# Altium schematic sheet trinamic-controller-dribbler.SchDoc
size B; SheetNumber: 9; SheetTotal: 13
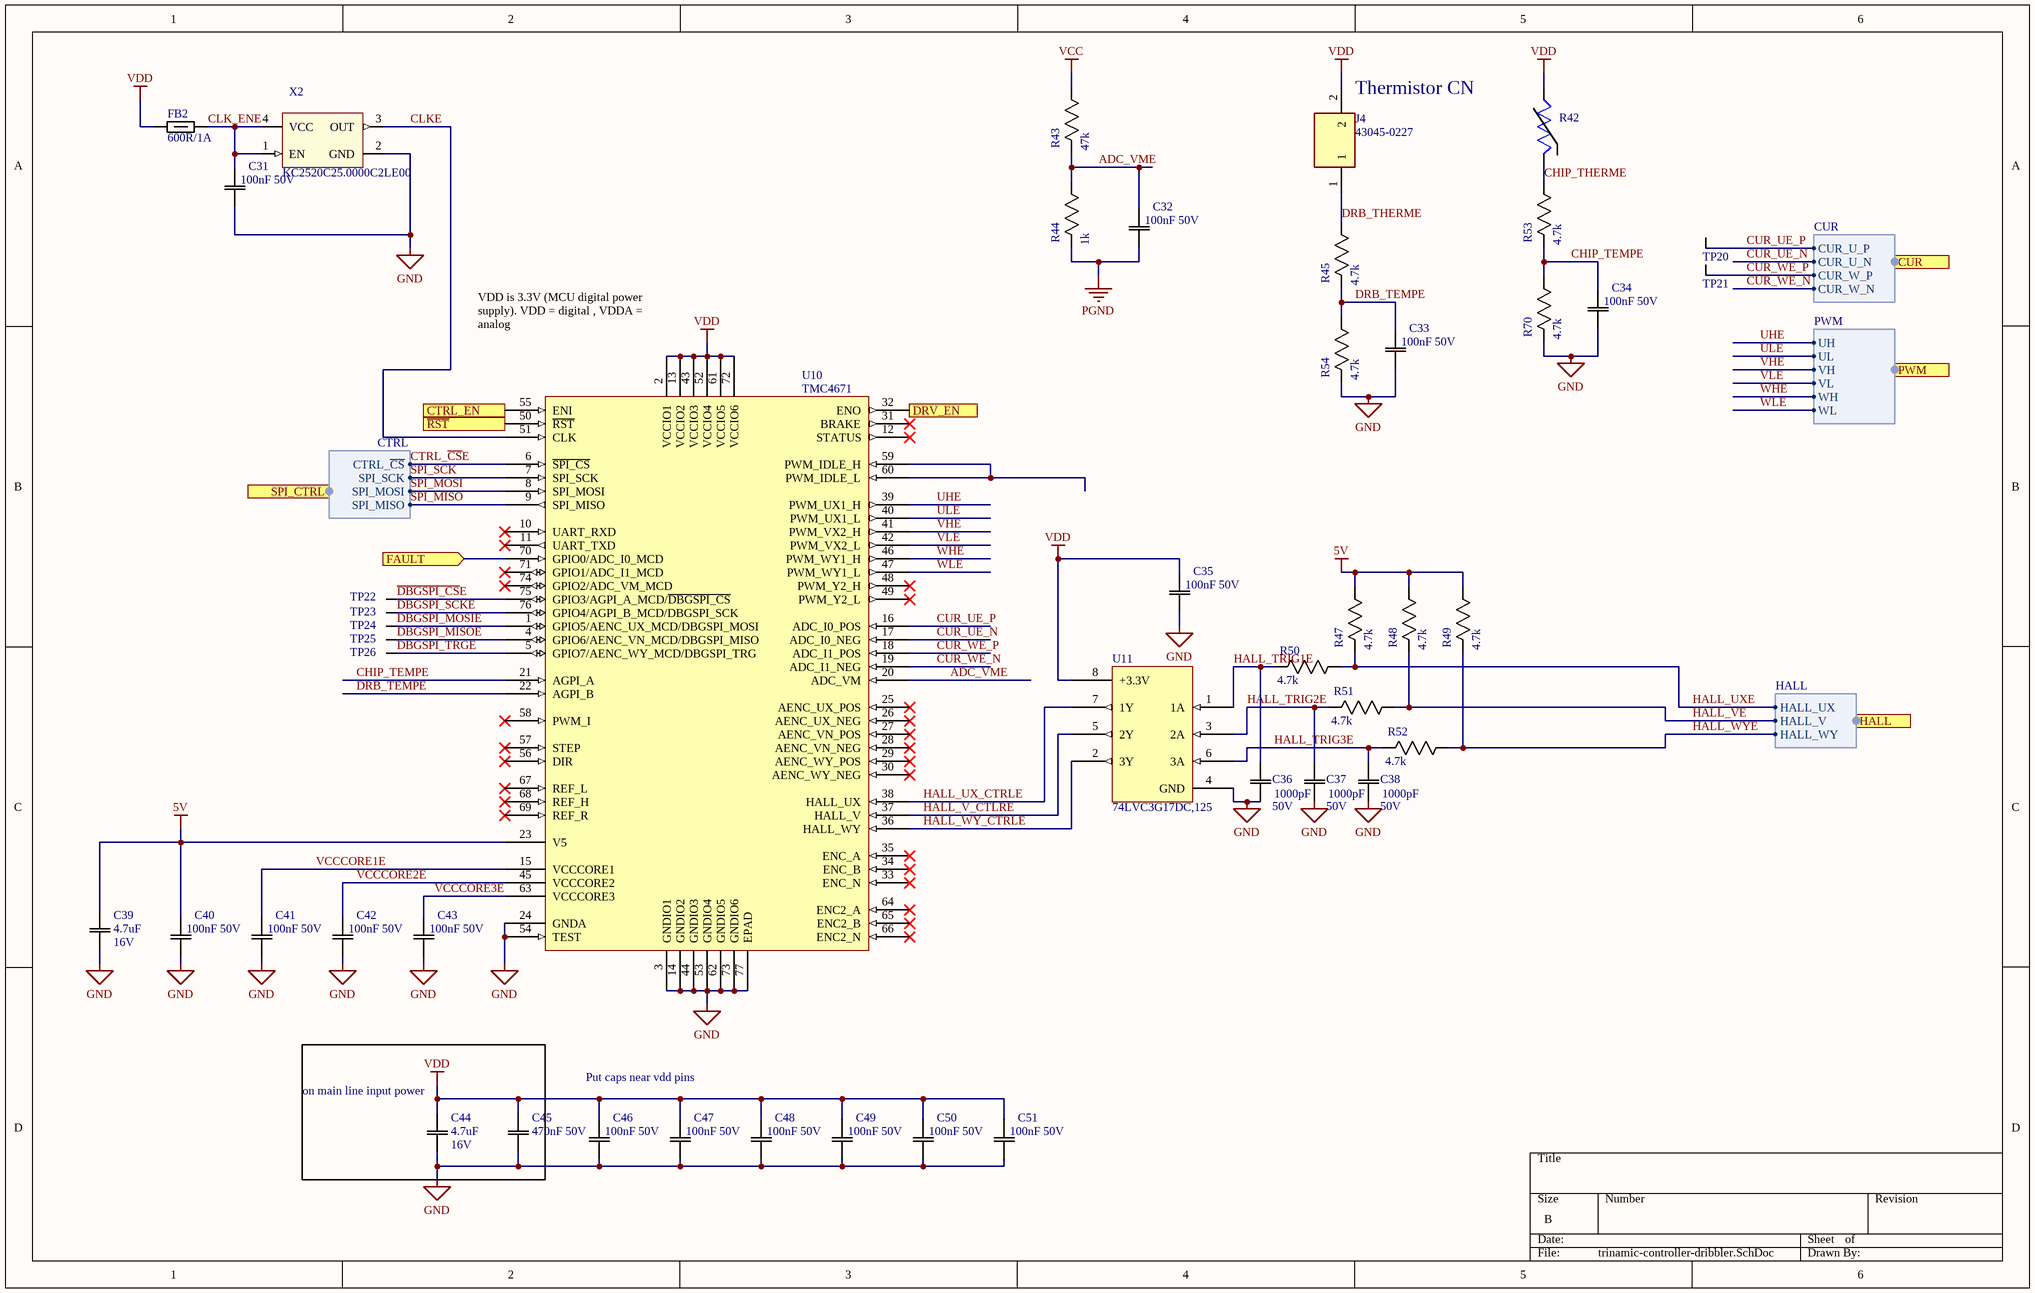
[diagram p0: trinamic-controller-dribbler.SchDoc]

## Parts
C31  100nF 50V  [0603]
C32  100nF 50V  [0603]
C33  100nF 50V  [0603]
C34  100nF 50V  [0603]
C35  100nF 50V  [0603]
C36  value 1000pF  Rating: 50V  [0603]  (hidden comment: 1000pF 50V)
C37  value 1000pF  Rating: 50V  [0603]  (hidden comment: 1000pF 50V)
C38  value 1000pF  Rating: 50V  [0603]  (hidden comment: 1000pF 50V)
C39  value 4.7uF  Rating: 16V  [0603]  (hidden comment: 4.7uF 16V)
C40  100nF 50V  [0603]
C41  100nF 50V  [0603]
C42  100nF 50V  [0603]
C43  100nF 50V  [0603]
C44  value 4.7uF  Rating: 16V  [0603]  (hidden comment: 4.7uF 16V)
C45  470nF 50V  [0603]
C46  100nF 50V  [0603]
C47  100nF 50V  [0603]
C48  100nF 50V  [0603]
C49  100nF 50V  [0603]
C50  100nF 50V  [0603]
C51  100nF 50V  [0603]
FB2  600R/1A  [0603]
J4  43045-0227  [MOLEX_0430450227]
R42  RES NTC 10k  [0603]  (value not drawn)
R43  47k  [0603]
R44  1k  [0603]
R45  4.7k  [0603]
R47  4.7k  [0603]
R48  4.7k  [0603]
R49  4.7k  [0603]
R50  4.7k  [0603]
R51  4.7k  [0603]
R52  4.7k  [0603]
R53  4.7k  [0603]
R54  4.7k  [0603]
R70  4.7k  [0603]
TP20  C_UE  [TP]  (value not drawn)  (no BOM)
TP21  C_WE  [TP]  (value not drawn)  (no BOM)
TP22  DBG_CS  [TP]  (value not drawn)  (no BOM)
TP23  DBG_SCK  [TP]  (value not drawn)  (no BOM)
TP24  DBG_MOSI  [TP]  (value not drawn)  (no BOM)
TP25  DBG_MISO  [TP]  (value not drawn)  (no BOM)
TP26  DBG_TRG  [TP]  (value not drawn)  (no BOM)
U10  TMC4671  [QFN40P1050X650X90_HS-77N]
U11  74LVC3G17DC,125  [8-VSSOP]
X2  KC2520C25.0000C2LE00  [KC2520C25.0000C2LE00]

## Blocks framed on the sheet
on main line input power: C44 C45

## Ports
CTRL_EN (in), CUR (harness CUR), DRV_EN (out), FAULT (in), HALL (harness HALL), PWM (harness PWM), SPI_CTRL (harness CTRL), ~{RST} (in)

## Harnesses
PWM: VL, WH, WL, VH, UL, UH
CTRL: SPI_SCK, SPI_MISO, SPI_MOSI, CTRL_~{CS}
CUR: CUR_U_P, CUR_W_P, CUR_U_N, CUR_W_N
HALL: HALL_UX, HALL_WY, HALL_V

## Nets
5V: C39.2(C2) C40.2(C2) R47.1(R1) R48.1(R1) R49.1(R1) U10.23(V5)
GND: C31.1(C1) C33.1(C1) C34.1(C1) C35.1(C1) C36.1(C1) C37.1(C1) C38.1(C1) C39.1(C1) C40.1(C1) C41.1(C1) C42.1(C1) C43.1(C1) C44.1(C1) C45.1(C1) C46.1(C1) C47.1(C1) C48.1(C1) C49.1(C1) C50.1(C1) C51.1(C1) R54.2(R2) R70.2(R2) U10.3(GNDIO1) U10.14(GNDIO2) U10.24(GNDA) U10.44(GNDIO3) U10.53(GNDIO4) U10.54(TEST) U10.62(GNDIO5) U10.73(GNDIO6) U10.77(EPAD) U11.4(GND) X2.2(GND)
PGND: C32.1(C1) R44.2(R2)
VCC: R43.1(R1)
VDD: C35.2(C2) C44.2(C2) C45.2(C2) C46.2(C2) C47.2(C2) C48.2(C2) C49.2(C2) C50.2(C2) C51.2(C2) FB2.1 J4.2 R42.2 U10.2(VCCIO1) U10.13(VCCIO2) U10.43(VCCIO3) U10.52(VCCIO4) U10.61(VCCIO5) U10.72(VCCIO6) U11.8(+3.3V)
ADC_VME: C32.2(C2) R43.2(R2) R44.1(R1) U10.20(ADC_VM)
CHIP_TEMPE: C34.2(C2) R53.2(R2) R70.1(R1) U10.21(AGPI_A)
CHIP_THERME: R42.1 R53.1(R1)
CLK_ENE: C31.2(C2) FB2.2 X2.1(EN) X2.4(VCC)
CLKE: U10.51(CLK) X2.3(OUT)
CTRL_~{CS}E: U10.6(~{SPI_CS}) ; port SPI_CTRL.CTRL_~{CS}
CTRL_EN: U10.55(ENI) ; port CTRL_EN
CUR_UE_N: U10.17(ADC_I0_NEG) ; port CUR.CUR_U_N
CUR_UE_P: TP20.1 U10.16(ADC_I0_POS) ; port CUR.CUR_U_P
CUR_WE_N: U10.19(ADC_I1_NEG) ; port CUR.CUR_W_N
CUR_WE_P: TP21.1 U10.18(ADC_I1_POS) ; port CUR.CUR_W_P
~{DBGSPI_CS}E: TP22.1 U10.75(GPIO3/AGPI_A_MCD/~{DBGSPI_CS})
DBGSPI_MISOE: TP25.1 U10.4(GPIO6/AENC_VN_MCD/DBGSPI_MISO)
DBGSPI_MOSIE: TP24.1 U10.1(GPIO5/AENC_UX_MCD/DBGSPI_MOSI)
DBGSPI_SCKE: TP23.1 U10.76(GPIO4/AGPI_B_MCD/DBGSPI_SCK)
DBGSPI_TRGE: TP26.1 U10.5(GPIO7/AENC_WY_MCD/DBGSPI_TRG)
DRB_TEMPE: C33.2(C2) R45.2(R2) R54.1(R1) U10.22(AGPI_B)
DRB_THERME: J4.1 R45.1(R1)
DRV_EN: U10.32(ENO) ; port DRV_EN
FAULT: U10.70(GPIO0/ADC_I0_MCD) ; port FAULT
HALL_TRIG1E: C36.2(C2) R50.2(R2) U11.1(1A)
HALL_TRIG2E: C37.2(C2) R51.2(R2) U11.3(2A)
HALL_TRIG3E: C38.2(C2) R52.2(R2) U11.6(3A)
HALL_UX_CTRLE: U10.38(HALL_UX) U11.7(1Y)
HALL_UXE: R47.2(R2) R50.1(R1) ; port HALL.HALL_UX
HALL_V_CTLRE: U10.37(HALL_V) U11.5(2Y)
HALL_VE: R48.2(R2) R51.1(R1) ; port HALL.HALL_V
HALL_WY_CTRLE: U10.36(HALL_WY) U11.2(3Y)
HALL_WYE: R49.2(R2) R52.1(R1) ; port HALL.HALL_WY
~{RST}: U10.50(~{RST}) ; port ~{RST}
SPI_MISO: U10.9(SPI_MISO) ; port SPI_CTRL.SPI_MISO
SPI_MOSI: U10.8(SPI_MOSI) ; port SPI_CTRL.SPI_MOSI
SPI_SCK: U10.7(SPI_SCK) ; port SPI_CTRL.SPI_SCK
UHE: U10.39(PWM_UX1_H) ; port PWM.UH
ULE: U10.40(PWM_UX1_L) ; port PWM.UL
VCCCORE1E: C41.2(C2) U10.15(VCCCORE1)
VCCCORE2E: C42.2(C2) U10.45(VCCCORE2)
VCCCORE3E: C43.2(C2) U10.63(VCCCORE3)
VHE: U10.41(PWM_VX2_H) ; port PWM.VH
VLE: U10.42(PWM_VX2_L) ; port PWM.VL
WHE: U10.46(PWM_WY1_H) ; port PWM.WH
WLE: U10.47(PWM_WY1_L) ; port PWM.WL
NetU10_59: U10.59(PWM_IDLE_H) U10.60(PWM_IDLE_L)

Not connected (* = marked no-connect by the designer): U10 10(UART_RXD)* 11(UART_TXD)* 12(STATUS)* 25(AENC_UX_POS)* 26(AENC_UX_NEG)* 27(AENC_VN_POS)* 28(AENC_VN_NEG)* 29(AENC_WY_POS)* 30(AENC_WY_NEG)* 31(BRAKE)* 33(ENC_N)* 34(ENC_B)* 35(ENC_A)* 48(PWM_Y2_H)* 49(PWM_Y2_L)* 56(DIR)* 57(STEP)* 58(PWM_I)* 64(ENC2_A)* 65(ENC2_B)* 66(ENC2_N)* 67(REF_L)* 68(REF_H)* 69(REF_R)* 71(GPIO1/ADC_I1_MCD)* 74(GPIO2/ADC_VM_MCD)*

## Notes on the sheet
- (near J4) Thermistor CN
- (near U10) VDD is 3.3V (MCU digital power supply). VDD = digital , VDDA = analog
- Put caps near vdd pins

## Library data of the parts
C31-C35 C40-C43 C46-C51 = CAP 100nF 50V: Default Symbol for Capacitors; Manufacturer Part Number 1: CC0603KPX7R9BB104; Tolerance: 10%; Temperature Coefficient: X7R; VALUE: 100nF; Rating: 50V; Part Number: CAP 100nF 50V; Supplier 1: Digi-Key; Supplier Part Number 1: 311-3567-1-ND; Manufacturer Part Number 2: 0805J0500104KJT; Supplier 2: Digi-Key; Supplier Part Number 2: 1608-1458-1-ND
C36-C38 = CAP 1000pF 50V: Default Symbol for Capacitors; Manufacturer Part Number 1: 06035C102K4Z2A / 06035C102K4Z2A; Tolerance: 10%; Temperature Coefficient: X7R; Part Number: CAP 1000pF 50V; Supplier 1: Digi-Key; Supplier Part Number 1: 478-6342-1-ND; Manufacturer Part Number 2: 08055C102KAT2A; Supplier 2: Digi-Key; Supplier Part Number 2: 478-1371-1-ND
C39 C44 = CAP 4.7uF 16V: Default Symbol for Capacitors; Manufacturer Part Number 1: C1608X5R1C475K080AE; Tolerance: 10%; Temperature Coefficient: X5R; Part Number: CAP 4.7uF 16V; Supplier 1: Digi-Key; Supplier Part Number 1: 445-175225-1-ND; Manufacturer Part Number 2: C2012X5R1C475K085AB; Supplier 2: Digi-Key; Supplier Part Number 2: 445-14382-1-ND
C45 = CAP 470nF 50V: Default Symbol for Capacitors; Manufacturer Part Number 1: C1608X7R1H474K080AC; Tolerance: 10%; Temperature Coefficient: X7R; VALUE: 470nF; Rating: 50V; Part Number: CAP 470nF 50V; Supplier 1: Digi-Key; Supplier Part Number 1: 445-5952-1-ND; Manufacturer Part Number 2: CL21B474KBFNNNG; Supplier 2: Digi-Key; Supplier Part Number 2: 1276-6482-1-ND
FB2 = FERRITE BEAD 200 MOHM 0603 1LN: WURTH ELEKTRONIK - 742792651 - Ferrite Bead, 0603 [1608 Metric], 600 ohm, 1 A, WE-CBF Series, 0.2 ohm, &#177; 25%; VALUE: 600R/1A @ 100 MHz; Supplier 1: Digi-Key; Supplier Part Number 1: 732-1593-1-ND; Part Number: FERRITE BEAD 200 MOHM 0603 1LN; Supplier URL 1: https://www.digikey.ca/en/products/detail/w%C3%BCrth-elektronik/742792651/1638997?s=N4IgTCBcDaIOwGYwFoCMBWAnAtyByAIiALoC%2BQA; Manufacturer Part Number 1: 742792651
J4 = CN HDR 2POS Molex 43045-0227: Molex 43045-0227 2POS Microfit / dual row, Vertical; Manufacturer Part Number 1: 0430450227; Part Number: CN HDR 2POS Molex 43045-0227; Supplier 1: Digi-Key; Supplier Part Number 1: WM10657-ND / WM10657-ND / WM10657-ND; Supplier URL 1: https://www.digikey.ca/en/products/detail/molex/0430450227/3310182?s=N4IgTCBcDaICwGYAMcCsSxgOwgLoF8g; Pin Count: 2
R42 = RES NTC 10k CHIP: Manufacturer Part Number 1: NCU18XH103F60RB; Tolerance: 1%; Part Number: RES NTC 10k CHIP; VALUE: 10k; Supplier 1: Digi-Key; Supplier Part Number 1: 490-16279-1-ND; Supplier URL 1: https://www.digikey.ca/en/products/detail/murata-electronics/NCU18XH103F60RB/7363023?s=N4IgTCBcDaICwE4AMBaAjANjAdgelAcgCIgC6AvkA
R43 = RES 47k 1/8W - 1%: Default Resistor Symbol; Manufacturer Part Number 1: MCT06030C4702FP500; Power (Watts): 0.125W; Tolerance: 1%; Package: 0805; VALUE: 47k; Part Number: RES 47k 1/8W - 1%; Supplier 1: Digi-Key; Supplier Part Number 1: MCT0603-47.0K-CFCT-ND; Manufacturer Part Number 2: AC0805FR-0747KL; Supplier 2: Digi-Key; Supplier Part Number 2: YAG3735CT-ND; Tolerance 2: 1%; Supplier URL 1: https://www.digikey.ca/en/products/detail/vishay-beyschlag-draloric-bc-components/MCT06030C4702FP500/2607854?s=N4IgTCBcDaILIGEAqAGAbCgzAWgCwHYA6FAaWwQDFlsA5AERAF0BfIA; Supplier URL 2: https://www.digikey.ca/en/products/detail/yageo/AC0805FR-0747KL/5896858?s=N4IgTCBcDaIJoEEDiBmA7CgrAYQCoFoA5AERAF0BfIA
R44 = RES 1k 1/8W - 1%: Default Resistor Symbol; Manufacturer Part Number 1: MCT06030C1001FP500; Power (Watts): 0.125W; Tolerance: 1%; Package: 0805; VALUE: 1k; Part Number: RES 1k 1/8W - 1%; Supplier 1: Digi-Key; Supplier Part Number 1: MCT0603-1.00K-CFCT-ND; Manufacturer Part Number 2: RMCF0805FT1K00; Supplier 2: Digi-Key; Supplier Part Number 2: RMCF0805FT1K00CT-ND; Tolerance 2: 1%; Supplier URL 1: https://www.digikey.ca/en/products/detail/vishay-beyschlag-draloric-bc-components/MCT06030C1001FP500/2607821?s=N4IgTCBcDaILIGEAqAGAbCgzAWgIwDoUUBpbBAMWWwDkAREAXQF8g; Supplier URL 2: https://www.digikey.ca/en/products/detail/stackpole-electronics-inc/RMCF0805FT1K00/1760090?s=N4IgTCBcDaIEoFkDCAxADADjQVhQFQEYBpNNJPEAXQF8g
R45 R53 R54 R70 = RES 4.7k 1/8W - 1%: Default Resistor Symbol; Manufacturer Part Number 1: RMCF0603FT4K70; Power (Watts): 0.125W; Tolerance: 1%; Package: 0805; VALUE: 4.7k; Part Number: RES 4.7k 1/8W - 1%; Supplier 1: Digi-Key; Supplier Part Number 1: RMCF0603FT4K70CT-ND; Supplier URL 1: https://www.digikey.ca/en/products/detail/stackpole-electronics-inc/RMCF0603FT4K70/1760998
R47-R52 = RES 4.7k 1/8W - 5%: Default Resistor Symbol; Manufacturer Part Number 1: RMCF0603JT4K70; Power (Watts): 0.125W; Tolerance: 5%; Package: 0805; VALUE: 4.7k; Part Number: RES 4.7k 1/8W - 5%; Supplier 1: Digi-Key; Supplier Part Number 1: RMCF0603JT4K70CT-ND; Supplier URL 1: https://www.digikey.ca/en/products/detail/stackpole-electronics-inc/RMCF0603JT4K70/1757976
TP20-TP26 = Test Point (Via): Part Number: Test Point (Via)
U10 = TMC4671: Motor Driver, -40 To 125Deg C Rohs Compliant: Yes; Manufacturer Part Number 1: TMC4671-LA; Supplier 1: Digi-Key; Supplier Part Number 1: 1460-TMC4671-LA-ND; Part Number: TMC4671; Supplier URL 1: https://www.digikey.ca/en/products/detail/trinamic-motion-control-gmbh/TMC4671-LA/12174669?s=N4IgTCBcDaIIwBYBsAGAtAFQLIGFkHY40AZAQTQDkAREAXQF8g
U11 = IC 74LVC3G17DC,125: IC BUFFER TRIPLE SCHMITT TRIGGER 5.5V VSSOP-8; Supplier 1: Newark; Supplier Part Number 1: 33AC1281; Part Number: IC 74LVC3G17DC,125; Supplier URL 1: https://canada.newark.com/nexperia/74lvc3g17dc-125/buffer-non-inverting-triple-vssop/dp/33AC1281?ost=33ac1281; Manufacturer Part Number 1: 74LVC3G17DC,125
X2 = XTAL OSC 25MHz 3.3V: Oscillator XO 25MHz ±15ppm 15pF CMOS 55% 2.5V/3.3V 4-Pin Mini-CSMD T/R; Frequency: 32.768kHz; Load Capacitance: 12.5pF; Supplier 1: Digi-Key; Supplier Part Number 1: 1253-1254-6-ND; Part Number: XTAL OSC 25MHz 3.3V; Supplier URL 1: https://www.digikey.ca/en/products/detail/kyocera-avx/KC2520C25-0000C2LE00/4867084?s=N4IgTCBcDaIIxgKwGYC0DEBZUDZUDkAREAXQF8g; Manufacturer Part Number 1: KC2520C25.0000C2LE00